# EAGLE design Endings_Controls (EAGLE 9.6.2)
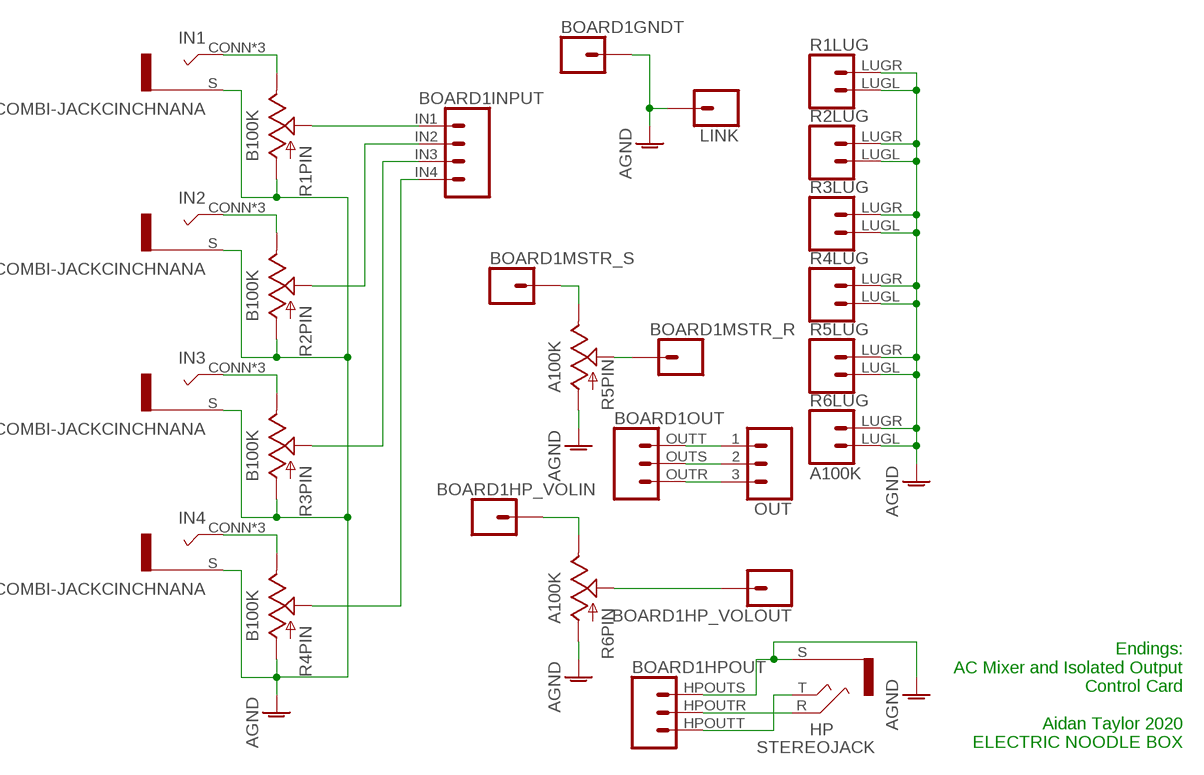
[diagram p0: schematic, sheet 1]

## Parts
BOARD1  ENDINGS_LINK  [ENDINGS]
HP  STEREOJACK  [STEREO_JACK_PANEL]
IN1  COMBI-JACKCINCHNANA  [NEWCOMBOJACK_PANEL]
IN2  COMBI-JACKCINCHNANA  [NEWCOMBOJACK_PANEL]
IN3  COMBI-JACKCINCHNANA  [NEWCOMBOJACK_PANEL]
IN4  COMBI-JACKCINCHNANA  [NEWCOMBOJACK_PANEL]
LINK  BANANA_PANEL  [CINCHNANA_PANEL]
OUT  3XWIREPAD  [1X03]
R1  B100K  POTENTIOMETER  [ALPHA_RV09_9MMPOT]
R2  B100K  POTENTIOMETER  [ALPHA_RV09_9MMPOT]
R3  B100K  POTENTIOMETER  [ALPHA_RV09_9MMPOT]
R4  B100K  POTENTIOMETER  [ALPHA_RV09_9MMPOT]
R5  A100K  POTENTIOMETER  [ALPHA_RV09_9MMPOT]
R6  A100K  POTENTIOMETER  [ALPHA_RV09_9MMPOT]

## Nets
AGND: BOARD1.GND1 BOARD1.GND2 BOARD1.GND3 BOARD1.GND4 BOARD1.HPOUTS HP.S IN1.S IN2.S IN3.S IN4.S LINK.CONN R1.C1(PIN:A) R1.LUGL R1.LUGR R2.C1(PIN:A) R2.LUGL R2.LUGR R3.C1(PIN:A) R3.LUGL R3.LUGR R4.C1(PIN:A) R4.LUGL R4.LUGR R5.C1(PIN:A) R5.LUGL R5.LUGR R6.C1(PIN:A) R6.LUGL R6.LUGR
N$1: IN1.CONN(T) IN1.T1(T) IN1.T2(T) R1.C3(PIN:B)
N$2: IN2.CONN(T) IN2.T1(T) IN2.T2(T) R2.C3(PIN:B)
N$3: IN3.CONN(T) IN3.T1(T) IN3.T2(T) R3.C3(PIN:B)
N$4: IN4.CONN(T) IN4.T1(T) IN4.T2(T) R4.C3(PIN:B)
N$5: BOARD1.IN1 R1.C2(PIN:W)
N$6: BOARD1.IN2 R2.C2(PIN:W)
N$7: BOARD1.IN3 R3.C2(PIN:W)
N$8: BOARD1.IN4 R4.C2(PIN:W)
N$9: BOARD1.MSTRVOLOUT R5.C3(PIN:B)
N$10: BOARD1.MSTRVOLIN R5.C2(PIN:W)
N$11: BOARD1.HPVOLIN R6.C3(PIN:B)
N$12: BOARD1.HPVOLOUT R6.C2(PIN:W)
N$13: BOARD1.OUTT OUT.1
N$14: BOARD1.OUTS OUT.2
N$15: BOARD1.OUTR OUT.3
N$16: BOARD1.HPOUTR HP.R
N$17: BOARD1.HPOUTT HP.T

## Notes on the sheet
- Endings:
  AC Mixer and Isolated Output
  Control Card
  
  Aidan Taylor 2020
  ELECTRIC NOODLE BOX

## Library data of the parts
BOARD1 = ElectricNoodleBox:ENDINGS_LINK
HP = ElectricNoodleBox:STEREOJACK
IN1-IN4 = ElectricNoodleBox:COMBI-JACK
LINK = ElectricNoodleBox:BANANA_PANEL
OUT = ElectricNoodleBox:3XWIREPAD
R1-R6 = ElectricNoodleBox:POTENTIOMETER

## Board
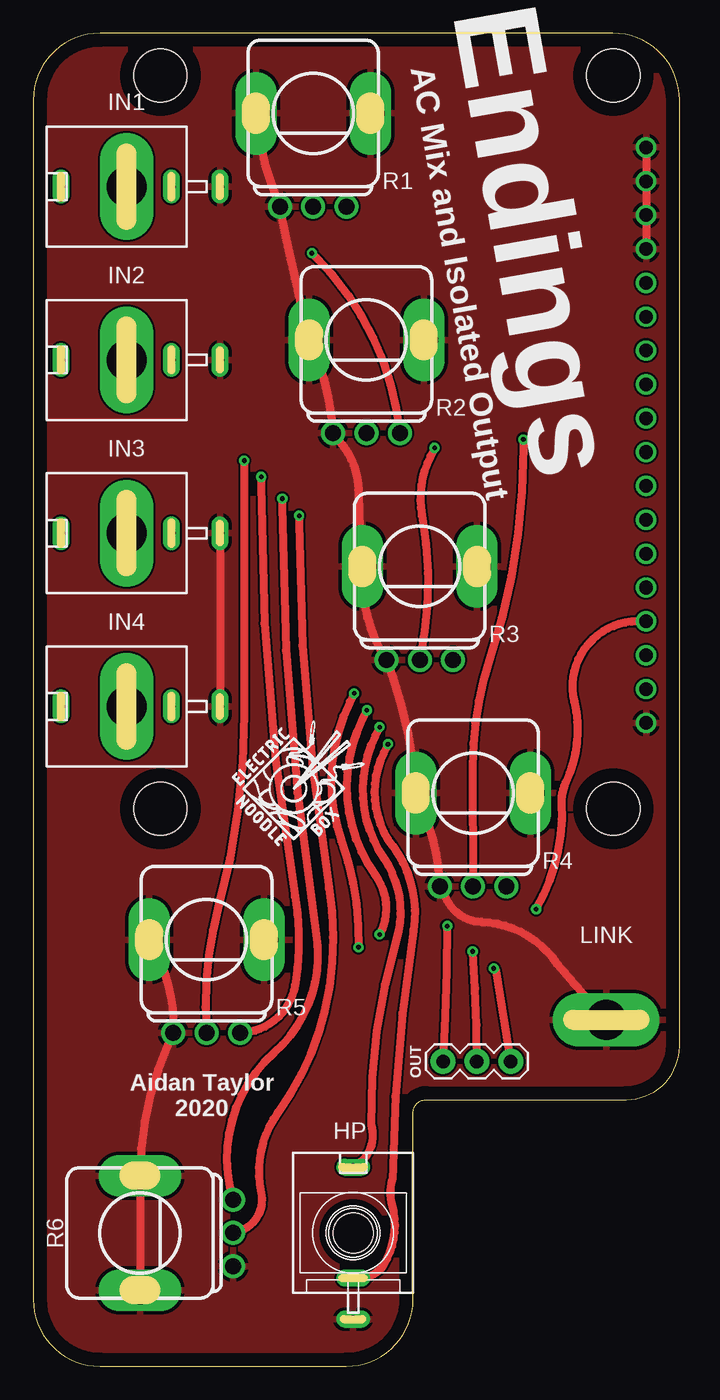
[diagram p1: board, top side]
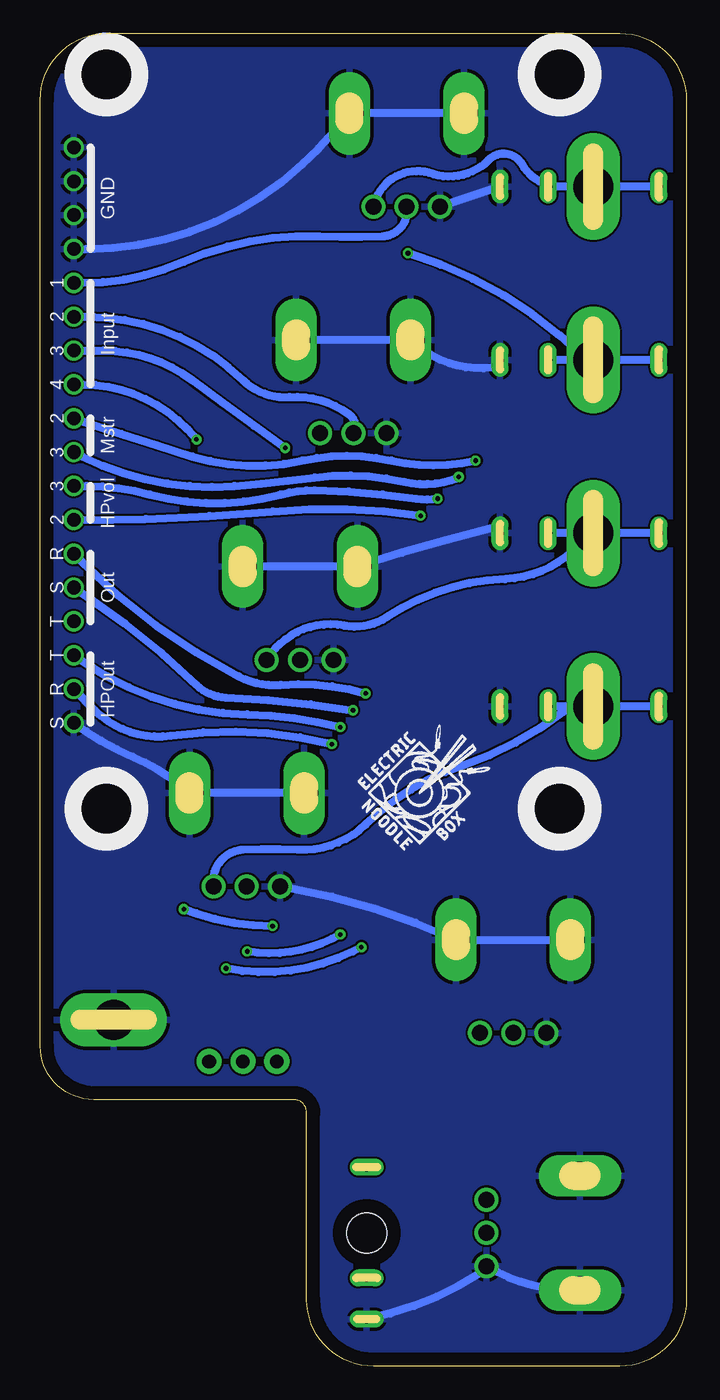
[diagram p2: board, bottom side, seen from below]

Size 48.5 x 100 mm. Coordinates in mm from the lower left corner, seen from the top.
Outline: 28.5,5 28.5,19 arc-90 29.5,20 44.5,20 arc90 48.5,24 48.5,95 arc90 43.5,100 5,100 arc90 0,95 0,5 arc90 5,0 23.5,0 arc90 28.5,5
Copper layers (1*16): Top 0.035mm / dielectric 1.5mm / Bottom 0.035mm
Design rules "default": minimum track width 6mil, minimum drill 0.35mm, track to track 6mil, track to pad 6mil, pad to pad 6mil, via to via 6mil, smd to smd 6mil, copper to edge 40mil, drill to drill 6mil, minimum pad ring 10mil, minimum via ring 8mil, stop-mask expansion 4mil, vias tented up to drill 0mil, thermal gap 10mil

### Footprints (pad centres in the part's own frame; a part is rotated, then mirrored left to right if it is on the bottom)
ENDINGS = drill 1.016: GND1 2.54,54.61; GND2 2.54,52.07; GND3 2.54,49.53; GND4 2.54,46.99; HPOUTR 2.54,13.97; HPOUTS 2.54,11.43; HPOUTT 2.54,16.51; HPVOLIN 2.54,29.21; HPVOLOUT 2.54,26.67; IN1 2.54,44.45; IN2 2.54,41.91; IN3 2.54,39.37; IN4 2.54,36.83; MSTRVOLIN 2.54,34.29; MSTRVOLOUT 2.54,31.75; OUTR 2.54,24.13; OUTS 2.54,21.59; OUTT 2.54,19.05 | hole 4: 5,5; 39,5; 39,60; 5,60
STEREO_JACK_PANEL = drill 0.6 pad 1.27 long: R 0,-3.38; S 0,-6.48; T 0,4.92 | hole 3: 0,0
NEWCOMBOJACK_PANEL = drill 3 pad 3.6 long: CONN 0,0 | drill 0.6 pad 1.27 long: S 0,-7; T1 0,4.92; T2 0,-3.38
CINCHNANA_PANEL = drill 3 pad 3.6 long: CONN 0,0
1X03 = drill 1.016 pad 1.88: 1 0,0; 2 2.54,0; 3 5.08,0
ALPHA_RV09_9MMPOT = drill 1.2 pad 1.778: C1 -2.5,-7; C2 0,-7; C3 2.5,-7 | drill 2.1 pad 2.8 long: LUGL -4.3,0; LUGR 4.3,0

### Placement (x,y rotation side)
BOARD1  48.53,36.83 0 bottom
HP  24,10 0 top
IN1  7,88.5 90 top
IN2  7,75.5 90 top
IN3  7,62.5 90 top
IN4  7,49.5 90 top
LINK  43,26 0 top
OUT  30.75,22.86 0 top
R1  21,94 0 top
R2  25,77 0 top
R3  29,60 0 top
R4  33,43 0 top
R5  13,32 0 top
R6  8,10 90 top
U$1  [LOGO10X10]  14.88,38.73 0 top
U$2  [LOGO10X10]  24.72,38.42 0 bottom

### Tracks (layer width: path | path; a pad name or v marks a point on that pad's centre or on a via)
AGND
  Top 0.61: BOARD1.GND1 BOARD1.GND2 BOARD1.GND3 BOARD1.GND4 | R1.LUGL 16.78,93.34 arc16 R1.C1 18.68,86.04 arc2 19.64,81.6 arc0 R2.LUGL 20.91,76.52 arc-19 R2.C1 23.13,69.22 arc-38 24.4,65.72 arc4 R3.LUGL 24.72,58.74 arc33 R3.C1 26.94,51.75 arc-16 R4.LUGL 29.16,41.91 arc-20 R4.C1 31.07,34.92 arc60 33.61,33.34 arc-54 39.32,30.16 arc3 LINK.CONN | R5.LUGL 9.16,31.11 arc-30 R5.C1 10.11,24.13 arc24 R6.LUGR R6.LUGL | IN3.S IN4.S
  Bottom 0.61: BOARD1.GND4 45.04,83.82 arc-43 28.84,90.17 arc-9 R1.LUGR R1.LUGL | IN1.S R1.C1 | IN2.S 14.56,74.93 arc52 R2.LUGL R2.LUGR | R4.C1 29.8,35.88 arc15 R5.LUGR R5.LUGL | R6.LUGL 8.84,5.71 arc30 R6.C1 15.51,6.99 arc22 HP.S | IN3.S 14.56,62.87 arc-4 R3.LUGL R3.LUGR | R4.LUGL R4.LUGR arc-18 41.55,45.72 arc10 45.04,47.62 BOARD1.HPOUTS
  pour Top: 0,0 48,0 48,100 0,100
  pour Bottom: 0,0 48,0 48,100 0,100
N$1
  Bottom 0.61: IN1.T1 IN1.CONN IN1.T2 11.06,88.9 arc29 12.34,90.17 arc-105 14.88,90.49 arc67 19.32,89.53 arc-93 R1.C3
N$2  (via drill 0.35)
  Top 0.61: v20.91,83.5 21.23,83.19 arc-39 R2.C3
  Bottom 0.61: IN2.T1 IN2.CONN | IN2.CONN IN2.T2 | IN2.CONN 7.57,75.56 arc-28 v20.91,83.5
N$3
  Bottom 0.61: IN3.T1 IN3.CONN | IN3.CONN IN3.T2 | IN3.CONN 7.57,62.23 arc51 13.61,59.05 arc-31 22.5,56.2 arc44 25.67,55.56 arc-69 R3.C3
N$4
  Bottom 0.61: IN4.T1 IN4.CONN | IN4.CONN IN4.T2 | IN4.CONN 7.57,50.48 arc23 16.78,45.09 arc-25 24.08,40.64 arc47 29.16,38.73 arc-6 33.29,38.73 arc-96 R4.C3
N$5
  Bottom 0.61: BOARD1.IN1 45.35,81.28 arc-24 37.73,82.87 arc26 27.57,84.77 arc-5 22.81,84.77 arc-97 R1.C2
N$6
  Bottom 0.61: BOARD1.IN2 45.04,78.74 arc44 33.29,73.98 arc-48 29.8,72.71 arc40 25.35,71.44 arc80 R2.C2
N$7  (via drill 0.35)
  Top 0.61: v30.11,68.9 29.8,68.26 arc37 29.16,63.82 arc-22 R3.C2
  Bottom 0.61: BOARD1.IN3 43.77,76.2 arc37 37.1,73.98 arc-2 v30.11,68.9
N$8  (via drill 0.35)
  Top 0.61: v36.78,69.53 36.78,68.9 arc-18 34.24,53.02 arc18 32.97,45.09 R4.C2
  Bottom 0.61: BOARD1.IN4 45.35,73.66 arc51 v36.78,69.53
N$9  (via drill 0.35)
  Top 0.61: v17.1,66.72 17.1,66.04 arc10 19.64,35.24 arc-19 19.64,28.57 arc-79 R5.C3
  Bottom 0.61: BOARD1.MSTRVOLOUT 45.35,68.26 arc-31 33.92,66.04 arc-3 27.89,66.67 arc20 21.23,66.36 arc-35 17.1,66.67 arc-145 v17.1,66.72
N$10  (via drill 0.35)
  Top 0.61: R5.C2 arc-19 13.92,34.61 arc15 15.83,48.9 v15.83,67.94
  Bottom 0.61: BOARD1.MSTRVOLIN 45.04,70.8 arc-1 37.1,68.26 arc-30 28.84,67.94 arc25 22.18,67.94 arc-25 v15.83,67.94
N$11  (via drill 0.35)
  Top 0.61: v18.68,65.09 18.68,64.45 arc9 21.23,32.38 arc-57 18.05,23.5 arc66 R6.C3
  Bottom 0.61: BOARD1.HPVOLIN 45.04,66.04 arc15 40.27,65.41 arc-30 30.43,65.41 arc16 27.89,65.72 arc8 20.27,65.09 arc-17 v18.68,65.09
N$12  (via drill 0.35)
  Top 0.61: v19.95,63.81 19.95,63.18 arc9 22.18,35.88 arc-23 21.86,26.67 arc-23 18.37,19.05 arc48 17.1,13.02 arc-94 R6.C2
  Bottom 0.61: BOARD1.HPVOLOUT 45.35,63.5 arc-5 31.07,64.14 arc13 v19.95,63.82 arc167 v19.95,63.81
N$13  (via drill 0.35)
  Top 0.61: BOARD1.OUTT 45.35,55.88 arc103 40.59,49.85 arc-39 39.96,43.81 arc28 39.64,42.23 arc-33 v37.73,34.29 | v31.07,33.02 31.04,32.99 arc-3 OUT.1
  Bottom 0.61: v37.73,34.29 36.78,33.97 arc-18 v31.07,33.02
N$14  (via drill 0.35)
  Top 0.61: v25.04,49.21 24.72,48.58 arc62 25.67,36.83 arc-64 v25.99,32.38 | v32.97,31.11 33,31.09 arc-4 OUT.2
  Bottom 0.61: BOARD1.OUTS 45.04,57.78 arc10 36.78,51.12 arc-42 34.56,50.16 arc7 v25.04,49.21 | v25.99,32.38 26.62,32.07 arc36 v32.97,31.11
N$15  (via drill 0.35)
  Top 0.61: v24.08,50.48 23.77,49.85 arc46 23.13,39.37 arc-21 v24.4,31.43 | OUT.3 34.74,29.66 arc-18 v34.56,29.84
  Bottom 0.61: BOARD1.OUTR 45.35,60.33 arc-18 33.61,51.75 arc-32 30.43,51.12 arc21 v24.08,50.48 | v24.4,31.43 25.04,31.11 arc38 v34.56,29.84
N$16  (via drill 0.35)
  Top 0.61: v26.62,46.67 26.3,46.04 arc64 26.94,39.05 arc-46 28.53,32.7 arc8 26.94,13.97 arc31 26.94,12.06 arc-47 26.3,7.62 arc-54 24.72,6.67 HP.R
  Bottom 0.61: BOARD1.HPOUTR 44.4,49.21 arc-53 38.69,47.31 arc22 v26.62,46.67
N$17  (via drill 0.35)
  Top 0.61: v25.99,47.94 25.67,47.31 arc61 26.3,38.1 arc-51 27.26,32.07 arc17 25.35,18.1 arc-79 HP.T
  Bottom 0.61: BOARD1.HPOUTT 45.04,52.7 arc-32 32.97,48.9 arc13 v25.99,47.94

### Text on the board
tPlace: Endings | AC Mix and Isolated Output | Aidan Taylor / 2020